# Altium schematic sheet MCU.SchDoc
size 279 x 215 mm
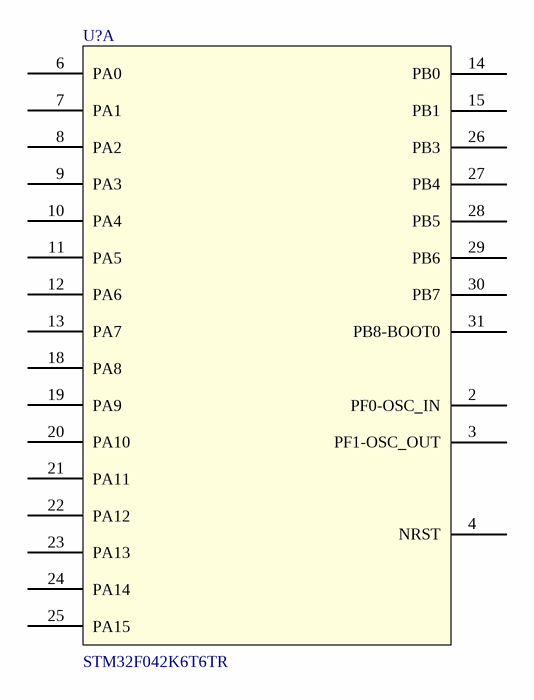
[diagram p0: MCU.SchDoc]

## Parts
U?  STM32F042K6T6TR  [LQFP-32]  (part A of 2)

## Nets

Not connected (* = marked no-connect by the designer): U? 2(PF0-OSC_IN) 3(PF1-OSC_OUT) 4(NRST) 6(PA0) 7(PA1) 8(PA2) 9(PA3) 10(PA4) 11(PA5) 12(PA6) 13(PA7) 14(PB0) 15(PB1) 18(PA8) 19(PA9) 20(PA10) 21(PA11) 22(PA12) 23(PA13) 24(PA14) 25(PA15) 26(PB3) 27(PB4) 28(PB5) 29(PB6) 30(PB7) 31(PB8-BOOT0)

## Notes on the sheet
- University of Waterloo Robotics Team
- 200 University Ave W
- REV
- PROJECT
- Waterloo, Ontario, Canada
- N2L 3G1
- DOCUMENT
- ENGINEER
- REVIEWER
- MODIFIED
- SHEET
- OF

## Library data of the parts
U? = STM32F042K6T6TR: No Description Available; Mfr_Name: STMicroelectronics; RefDes: RefDes; Type: Type